# EAGLE design nano shield (EAGLE 8.6.1)
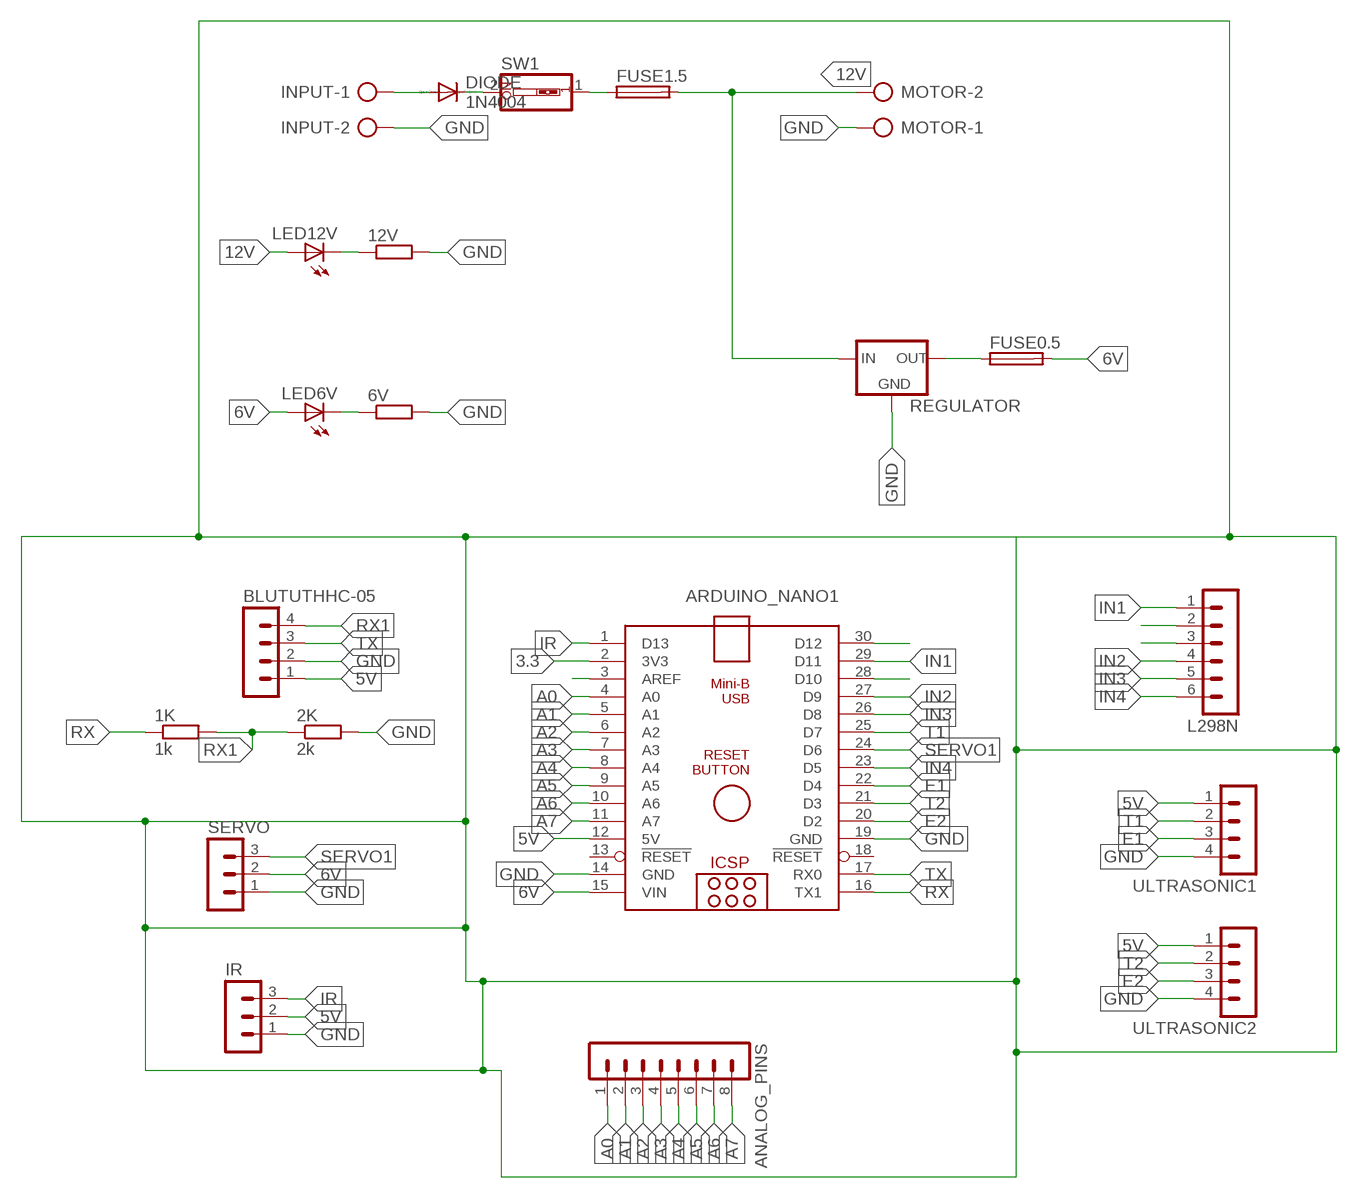
[diagram p0: schematic, sheet 1]

## Parts
1K  1k  R-EU_0207/10  [0207/10]
2K  2k  R-EU_0207/10  [0207/10]
6V  R-EU_0204/7  [0204/7]
12V  R-EU_0204/7  [0204/7]
ANALOG_PINS  MA08-1  [MA08-1]
ARDUINO_NANO1  ARDUINO_NANO  [ARDUINO_NANO]
BLUTUTHHC-05  MA04-1  [MA04-1]
DIODE  1N4004  [DO41-10]
FUSE0.5  SH22,5  [SH22,5]
FUSE1.5  SH22,5  [SH22,5]
INPUT  AK500/2-H  [AK500/2-H]
IR  MA03-1  [MA03-1]
L298N  MA06-1  [MA06-1]
LED6V  LEDLSU260  [LSU260]
LED12V  LEDLSU260  [LSU260]
MOTOR  AK500/2-H  [AK500/2-H]
REGULATOR  78XXS  [78XXS]
SERVO  MA03-1  [MA03-1]
SW1  SW_DIP-1  [EDG-01]
ULTRASONIC1  MA04-1  [MA04-1]
ULTRASONIC2  MA04-1  [MA04-1]

## Nets
3.3: ARDUINO_NANO1.2(3V3)
5V: ARDUINO_NANO1.12(5V) BLUTUTHHC-05.1 IR.2 ULTRASONIC1.1 ULTRASONIC2.1
6V: ARDUINO_NANO1.15(VIN) FUSE0.5.2 LED6V.A SERVO.2
12V: FUSE1.5.2 LED12V.A MOTOR.2 REGULATOR.IN
A0: ANALOG_PINS.1 ARDUINO_NANO1.4(A0)
A1: ANALOG_PINS.2 ARDUINO_NANO1.5(A1)
A2: ANALOG_PINS.3 ARDUINO_NANO1.6(A2)
A3: ANALOG_PINS.4 ARDUINO_NANO1.7(A3)
A4: ANALOG_PINS.5 ARDUINO_NANO1.8(A4)
A5: ANALOG_PINS.6 ARDUINO_NANO1.9(A5)
A6: ANALOG_PINS.7 ARDUINO_NANO1.10(A6)
A7: ANALOG_PINS.8 ARDUINO_NANO1.11(A7)
E1: ARDUINO_NANO1.22(D4) ULTRASONIC1.3
E2: ARDUINO_NANO1.20(D2) ULTRASONIC2.3
GND: 2K.2 6V.2 12V.2 ARDUINO_NANO1.14(GND) ARDUINO_NANO1.19(GND) BLUTUTHHC-05.2 INPUT.2 IR.1 MOTOR.1 REGULATOR.GND SERVO.1 ULTRASONIC1.4 ULTRASONIC2.4
IN1: ARDUINO_NANO1.30(D12) L298N.1
IN2: ARDUINO_NANO1.27(D9) L298N.4
IN3: ARDUINO_NANO1.26(D8) L298N.5
IN4: ARDUINO_NANO1.23(D5) L298N.6
IR: ARDUINO_NANO1.1(D13) IR.3
N$1: DIODE.A INPUT.1
N$2: DIODE.C SW1.2
N$3: FUSE1.5.1 SW1.1
N$5: FUSE0.5.1 REGULATOR.OUT
N$7: 6V.1 LED6V.K(C)
N$9: 12V.1 LED12V.K(C)
N$11: ARDUINO_NANO1.3(AREF)
PWM1: ARDUINO_NANO1.29(D11) L298N.2
PWM2: ARDUINO_NANO1.28(D10) L298N.3
RX: 1K.1 ARDUINO_NANO1.16(TX1)
RX1: 1K.2 2K.1 BLUTUTHHC-05.4
SERVO1: ARDUINO_NANO1.24(D6) SERVO.3
T1: ARDUINO_NANO1.25(D7) ULTRASONIC1.2
T2: ARDUINO_NANO1.21(D3) ULTRASONIC2.2
TX: ARDUINO_NANO1.17(RX0) BLUTUTHHC-05.3
Unconnected: ARDUINO_NANO1.13(!RESET) ARDUINO_NANO1.18(!RESET)

## Library data of the parts
1K 2K = rcl:R-EU_: RESISTOR, European symbol; SPICEPREFIX: R
6V 12V = resistor:R-EU_: RESISTOR, European symbol
ANALOG_PINS = con-lstb:MA08-1: PIN HEADER; OC_FARNELL: unknown; OC_NEWARK: unknown
ARDUINO_NANO1 = ArduinoNanoV30:ARDUINO_NANO: Arduino Nano V3.0 Overview: The Arduino Nano is a small, complete, and breadboard-friendly board based on the ATmega328 (Arduino Nano 3.x) or ATmega168 (Arduino Nano 2.x). It has more or less the same functionality of the Arduino Duemilanove, but in a different package. It lacks only a DC power jack, and works with a Mini-B USB cable instead of a standard one. The Nano was designed and is being produced by Gravitech. Specifications: Microcontroller Atmel ATmega168 or ATmega328 Operating Voltage (logic level) 5 V Input Voltage (recommended) 7-12 V Input Voltage (limits) 6-20 V Digital I/O Pins 14 (of which 6 provide PWM output) Analog Input Pins 8 DC Current per I/O Pin 40 mA Flash Memory 16 KB (ATmega168) or 32 KB (ATmega328) of which 2 KB used by bootloader SRAM 1 KB (ATmega168) or 2 KB (ATmega328) EEPROM 512 bytes (ATmega168) or 1 KB (ATmega328) Clock Speed 16 MHz Dimensions 0.73" x 1.70" Length 45 mm Width 18 mm Weigth 5 g Power: The Arduino Nano can be powered via the Mini-B USB connection, 6-20V unregulated external power supply (pin 30), or 5V regulated external power supply (pin 27). The power source is automatically selected to the highest voltage source. Memory: The ATmega168 has 16 KB of flash memory for storing code (of which 2 KB is used for the bootloader); the ATmega328 has 32 KB, (also with 2 KB used for the bootloader). The ATmega168 has 1 KB of SRAM and 512 bytes of EEPROM (which can be read and written with the EEPROM library); the ATmega328 has 2 KB of SRAM and 1 KB of EEPROM. Input and Output: Each of the 14 digital pins on the Nano can be used as an input or output, using pinMode(), digitalWrite(), and digitalRead() functions. They operate at 5 volts. Each pin can provide or receive a maximum of 40 mA and has an internal pull-up resistor (disconnected by default) of 20-50 kOhms. In addition, some pins have specialized functions. Visit Arduino - ArduinoBoardNano <https://www.arduino.cc/en/Main/ArduinoBoardNano>
BLUTUTHHC-05 ULTRASONIC1 ULTRASONIC2 = con-lstb:MA04-1: PIN HEADER; OC_FARNELL: unknown; OC_NEWARK: unknown
DIODE = diode:1N4004: DIODE general purpose rectifier, 1 A
FUSE0.5 FUSE1.5 = fuse:SH22,5: FUSE HOLDER grid 22,5 mm, OGN0031 8201, Schurter (Buerklin); MF: SCHURTER; MPN: 0031.8201; OC_FARNELL: 1162740; OC_NEWARK: 96F8317
INPUT MOTOR = con-ptr500:AK500/2-H: CONNECTOR Aug. 2004 / PTR Meßtechnik: Die Bezeichnung der Serie AK505 wurde geändert. Es handelt sich hierbei um AK500 in horizontaler Ausführung.; OC_FARNELL: unknown; OC_NEWARK: unknown
IR SERVO = con-lstb:MA03-1: PIN HEADER; OC_FARNELL: unknown; OC_NEWARK: unknown
L298N = con-lstb:MA06-1: PIN HEADER; OC_FARNELL: unknown; OC_NEWARK: unknown
LED6V LED12V = led:LED: LED OSRAM: - CHIPLED LG R971, LG N971, LY N971, LG Q971, LY Q971, LO R971, LY R971 LH N974, LH R974 LS Q976, LO Q976, LY Q976 LO Q996 - Hyper CHIPLED LW Q18S LB Q993, LB Q99A, LB R99A - SideLED LS A670, LO A670, LY A670, LG A670, LP A670 LB A673, LV A673, LT A673, LW A673 LH A674 LY A675 LS A676, LA A676, LO A676, LY A676, LW A676 LS A679, LY A679, LG A679 - Hyper Micro SIDELED® LS Y876, LA Y876, LO Y876, LY Y876 LT Y87S - SmartLED LW L88C, LW L88S LB L89C, LB L89S, LG L890 LS L89K, LO L89K, LY L89K LS L896, LA L896, LO L896, LY L896 - TOPLED LS T670, LO T670, LY T670, LG T670, LP T670 LSG T670, LSP T670, LSY T670, LOP T670, LYG T670 LG T671, LOG T671, LSG T671 LB T673, LV T673, LT T673, LW T673 LH T674 LS T676, LA T676, LO T676, LY T676, LB T676, LH T676, LSB T676, LW T676 LB T67C, LV T67C, LT T67C, LS T67K, LO T67K, LY T67K, LW E67C LS E67B, LA E67B, LO E67B, LY E67B, LB E67C, LV E67C, LT E67C LW T67C LS T679, LY T679, LG T679 LS T770, LO T770, LY T770, LG T770, LP T770 LB T773, LV T773, LT T773, LW T773 LH T774 LS E675, LA E675, LY E675, LS T675 LS T776, LA T776, LO T776, LY T776, LB T776 LHGB T686 LT T68C, LB T68C - Hyper Mini TOPLED® LB M676 - Mini TOPLED Santana® LG M470 LS M47K, LO M47K, LY M47K Source: http://www.osram.convergy.de LUXEON: - LUMILED® LXK2-PW12-R00, LXK2-PW12-S00, LXK2-PW14-U00, LXK2-PW14-V00 LXK2-PM12-R00, LXK2-PM12-S00, LXK2-PM14-U00 LXK2-PE12-Q00, LXK2-PE12-R00, LXK2-PE12-S00, LXK2-PE14-T00, LXK2-PE14-U00 LXK2-PB12-K00, LXK2-PB12-L00, LXK2-PB12-M00, LXK2-PB14-N00, LXK2-PB14-P00, LXK2-PB14-Q00 LXK2-PR12-L00, LXK2-PR12-M00, LXK2-PR14-Q00, LXK2-PR14-R00 LXK2-PD12-Q00, LXK2-PD12-R00, LXK2-PD12-S00 LXK2-PH12-R00, LXK2-PH12-S00 LXK2-PL12-P00, LXK2-PL12-Q00, LXK2-PL12-R00 Source: www.luxeon.com KINGBRIGHT: KA-3528ASYC Source: www.kingbright.com
REGULATOR = v-reg:78XXS: VOLTAGE REGULATOR
SW1 = special:SW_DIP-1: DIP SWITCH

## Board
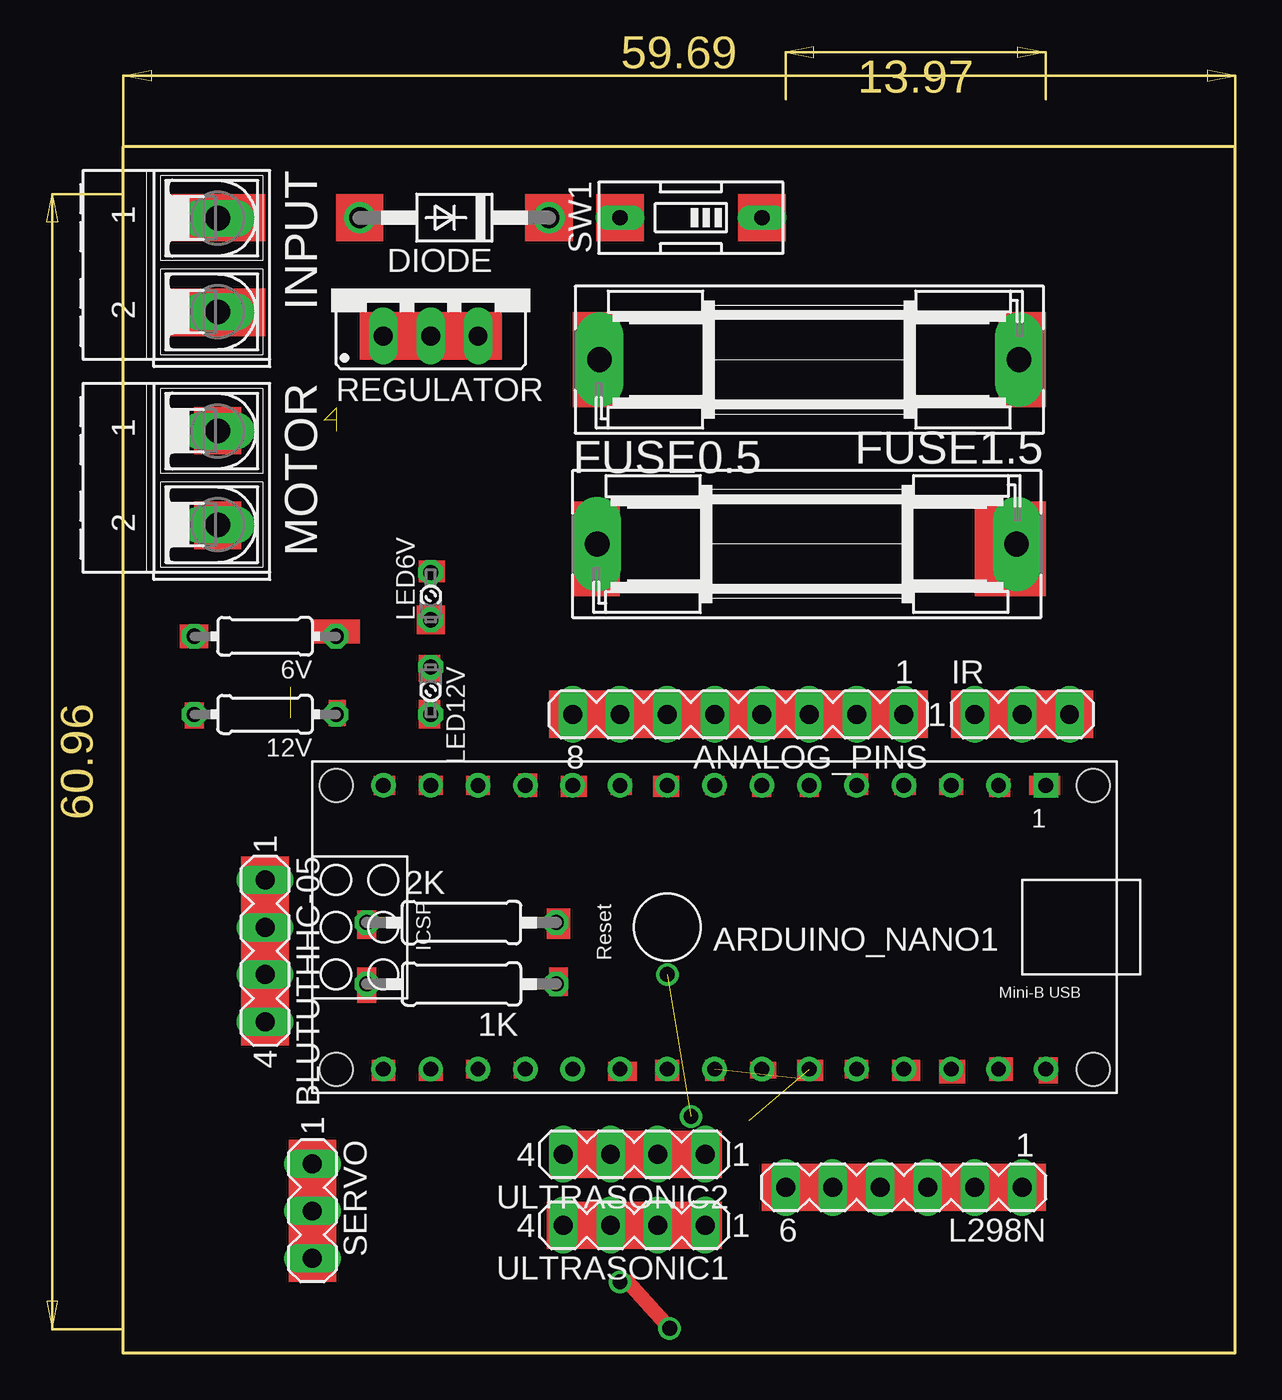
[diagram p1: board, top side]
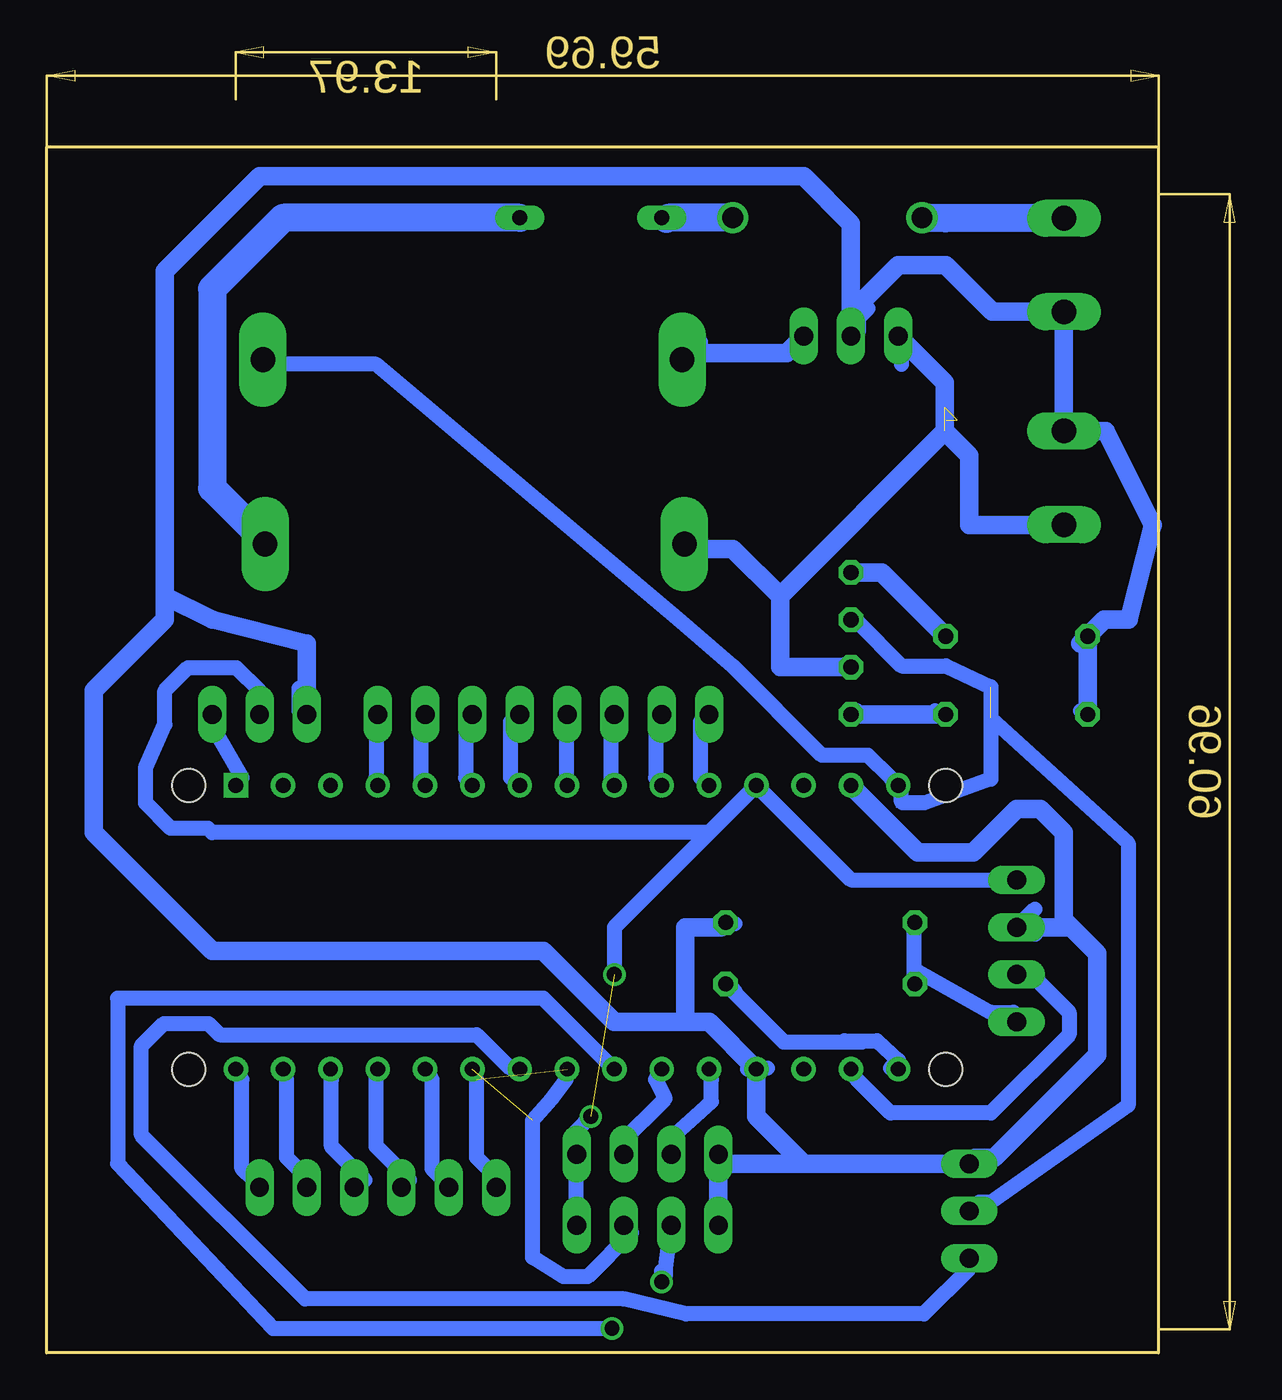
[diagram p2: board, bottom side, seen from below]

Size 59.69 x 64.77 mm. Coordinates in mm from the lower left corner, seen from the top.
Outline: 0,0 59.69,0 59.69,64.77 0,64.77 0,0
Copper layers (1*16): Top 0.035mm / dielectric 1.5mm / Bottom 0.035mm
Design rules "default *": minimum track width 0.8mm, minimum drill 0.8mm, track to track 0.4mm, track to pad 0.4mm, pad to pad 6mil, via to via 6mil, smd to smd 6mil, copper to edge 40mil, drill to drill 6mil, minimum pad ring 10mil, minimum via ring 8mil, stop-mask expansion 4mil, vias tented up to drill 0mil, thermal gap 10mil

### Footprints (pad centres in the part's own frame; a part is rotated, then mirrored left to right if it is on the bottom)
0207/10 = drill 0.813 octagon: 1 -5.08,0; 2 5.08,0
0204/7 = drill 0.813 octagon: 1 -3.81,0; 2 3.81,0
MA08-1 = drill 1.016 long: 1 -8.89,0; 2 -6.35,0; 3 -3.81,0; 4 -1.27,0; 5 1.27,0; 6 3.81,0; 7 6.35,0; 8 8.89,0
ARDUINO_NANO = drill 0.8 square: 1 -20.32,-7.62 | drill 0.8: 2 -17.78,-7.62; 3 -15.24,-7.62; 4 -12.7,-7.62; 5 -10.16,-7.62; 6 -7.62,-7.62; 7 -5.08,-7.62; 8 -2.54,-7.62; 9 0,-7.62; 10 2.54,-7.62; 11 5.08,-7.62; 12 7.62,-7.62; 13 10.16,-7.62; 14 12.7,-7.62; 15 15.24,-7.62; 16 15.24,7.62; 17 12.7,7.62; 18 10.16,7.62; 19 7.62,7.62; 20 5.08,7.62; 21 2.54,7.62; 22 0,7.62; 23 -2.54,7.62; 24 -5.08,7.62; 25 -7.62,7.62; 26 -10.16,7.62; 27 -12.7,7.62; 28 -15.24,7.62; 29 -17.78,7.62; 30 -20.32,7.62 | hole 1.778: -22.86,-7.62; -22.86,7.62; 17.78,7.62; 17.78,-7.62
MA04-1 = drill 1.016 long: 1 -3.81,0; 2 -1.27,0; 3 1.27,0; 4 3.81,0
DO41-10 = drill 1.118: A 5.08,0; C -5.08,0
SH22,5 = drill 1.321 pad 2.54 long: 1 -11.252,0; 2 11.252,0
AK500/2-H = drill 1.321 long: 1 -2.515,0; 2 2.515,0
MA03-1 = drill 1.016 long: 1 -2.54,0; 2 0,0; 3 2.54,0
MA06-1 = drill 1.016 long: 1 -6.35,0; 2 -3.81,0; 3 -1.27,0; 4 1.27,0; 5 3.81,0; 6 6.35,0
LSU260 = drill 0.813 octagon: A -1.27,0; K 1.27,0
78XXS = drill 1.016 long: GND 0,-2.54; IN -2.54,-2.54; OUT 2.54,-2.54
EDG-01 = drill 0.813 long: 1 0,-3.81; 2 0,3.81

### Placement (x,y rotation side)
1K  18.16,19.81 180 top
2K  18.16,23.11 0 top
6V  7.62,38.48 180 top
12V  7.62,34.29 180 top
ANALOG_PINS  33.02,34.29 180 top
ARDUINO_NANO1  29.21,22.86 180 top
BLUTUTHHC-05  7.62,21.59 270 top
DIODE  17.78,60.96 180 top
FUSE0.5  36.83,53.34 0 top
FUSE1.5  36.7,43.43 180 top
INPUT  5.08,58.42 270 top
IR  48.26,34.29 0 top
L298N  41.91,8.89 180 top
LED6V  16.51,40.64 90 top
LED12V  16.51,35.56 270 top
MOTOR  5.08,46.99 270 top
REGULATOR  16.51,57.15 0 top
SERVO  10.16,7.62 270 top
SW1  30.48,60.96 90 top
ULTRASONIC1  27.43,6.86 180 top
ULTRASONIC2  27.43,10.67 180 top

### Tracks (layer width: path | path; a pad name or v marks a point on that pad's centre or on a via)
5V  (via drill 0.8)  (1 unrouted)
  Bottom 0.8: ULTRASONIC1.1 31.29,7.05 31.29,10.65 ULTRASONIC2.1 31.24,11.94 v30.48,12.7 | 24.13,27.94 ARDUINO_NANO1.12 16.51,25.4 BLUTUTHHC-05.1 | 24.13,27.94 50.8,27.94 51.03,28.18 53.02,28.18 54.38,29.52 54.38,31.43 53.34,33.74 53.34,35.56 52.1,36.8 49.5,36.8 48.26,35.56 IR.2 | 24.13,27.94 29.21,22.86 v29.21,20.32
6V  (1 unrouted)
  Bottom 0.8: LED6V.A 16.2,39.29 13.8,36.89 11.4,36.89 9,35.76 9,30.81 12.55,29.54 13.75,29.54 13.8,29.59 13.8,30.29 ARDUINO_NANO1.15 14.4,30.89 15.6,32.09 18.07,32.09 22.87,36.89 25.8,39.43 42,53.09 48,53.09 FUSE0.5.2 | 9,34.1 1.64,27.37 1.64,13.29 9,8.09 9.6,8.09 SERVO.2
12V  (3 unrouted)
  Bottom 0.8: 16.8,36.89 LED12V.A | 25.2,43.03 FUSE1.5.2 | 13.8,53.09 13.8,54.29 REGULATOR.IN | 5.4,44.69 MOTOR.2
  Bottom 1: FUSE1.5.2 25.2,43.18 22.86,43.18 20.32,40.64 | 20.32,40.64 20.32,36.83 16.86,36.83 16.8,36.89 | 20.32,40.64 11.47,49.49 | REGULATOR.IN 11.47,52.11 11.47,49.49 | 11.47,49.49 10.16,48.18 10.16,44.45 5.11,44.45 MOTOR.2
A0
  Bottom 0.8: ARDUINO_NANO1.4 42,30.89 42,33.89 ANALOG_PINS.1
A1
  Bottom 0.8: ARDUINO_NANO1.5 39.6,30.89 39.6,33.89 ANALOG_PINS.2
A2
  Bottom 0.8: ARDUINO_NANO1.6 37.2,30.89 37.2,33.89 ANALOG_PINS.3
A3
  Bottom 0.8: ARDUINO_NANO1.7 34.8,30.89 34.8,33.89 ANALOG_PINS.4
A4
  Bottom 0.8: ARDUINO_NANO1.8 31.8,30.89 31.8,33.89 ANALOG_PINS.5
A5
  Bottom 0.8: ARDUINO_NANO1.9 29.4,30.89 29.4,33.89 ANALOG_PINS.6
A6
  Bottom 0.8: ARDUINO_NANO1.10 27,30.89 27,33.89 ANALOG_PINS.7
A7
  Bottom 0.8: ARDUINO_NANO1.11 24.6,30.89 24.6,33.89 ANALOG_PINS.8
E1  (via drill 0.8)
  Top 0.8: v29.34,1.31 27.09,3.81 v26.67,3.81
  Bottom 0.8: ARDUINO_NANO1.22 33.02,19.05 55.88,19.05 55.88,10.16 47.54,1.31 v29.34,1.31 | ULTRASONIC1.3 26.45,4.61 26.45,4.18 26.67,4.39 v26.67,3.81
E2
  Bottom 0.8: ARDUINO_NANO1.20 24,14.69 24,13.49 26.49,11.25 ULTRASONIC2.3
GND
  Bottom 0.8: 10.2,10.49 SERVO.1 | 23.49,11.25 ULTRASONIC2.4 | 6.6,22.49 7.2,22.49 BLUTUTHHC-05.2 6.64,23.84 | 4.2,34.49 12V.2 | 4.2,38.09 6V.2 3.6,38.69 | 15.6,56.09 16.2,55.49 16.2,54.89 REGULATOR.GND | 5.4,56.09 INPUT.2 5.4,55.49 | 5.4,50.09 MOTOR.1 4.8,49.49 | 21.6,15.29 ARDUINO_NANO1.19 | 46.13,35.69 46.13,34.49 IR.1 | 2K.2 22.73,23.05 | 21,15.29 ARDUINO_NANO1.19 | ARDUINO_NANO1.19 22.07,15.24
  Bottom 1: 16.2,54.89 16.2,56.19 13.97,58.42 11.43,58.42 8.91,55.91 INPUT.2 MOTOR.1 2.84,49.5 0.32,44.45 1.59,39.37 2.92,39.37 4.2,38.09 | 6V.2 12V.2 | REGULATOR.GND 16.51,60.64 19.05,63.18 48.26,63.18 53.34,58.1 53.34,40.64 | IR.1 45.72,38.1 50.8,39.37 53.34,40.64 | 53.34,40.64 53.34,39.37 57.15,35.56 57.15,27.94 50.8,21.59 33.02,21.59 29.21,17.78 25.4,17.78 | 25.4,17.78 24.13,17.78 ARDUINO_NANO1.19 21.59,12.7 19.05,10.16 | 2K.2 23.5,22.86 25.4,22.86 25.4,17.78 | 19.05,10.16 SERVO.1 9.83,10.49 8.81,10.49 3.3,16 3.3,21.46 4.7,22.86 | 19.05,10.16 23.11,10.16 ULTRASONIC2.4 ULTRASONIC1.4 | 4.7,22.86 BLUTUTHHC-05.2 | 4.7,22.86 5.08,23.24 5.08,27.94 6.35,29.21 7.62,29.21 7.83,29 7.83,28.99 9.94,26.87 12.92,26.87 16.51,30.46 ARDUINO_NANO1.14
IN1
  Bottom 0.8: ARDUINO_NANO1.30 49.2,14.69 49.2,9.89 48.6,9.29 L298N.1
IN2
  Bottom 0.8: ARDUINO_NANO1.27 42,14.69 42,11.09 40.2,9.29 L298N.4
IN3
  Bottom 0.8: ARDUINO_NANO1.26 39,14.69 39,9.89 38.4,9.29 L298N.5
IN4  (1 unrouted)
  Bottom 0.8: 36.6,14.69 36.6,10.49 35.4,9.29 L298N.6
IR
  Bottom 0.8: ARDUINO_NANO1.1 49.2,30.89 50.93,33.89 IR.3
N$1
  Bottom 0.8: 12.6,60.89 DIODE.A | 5.4,60.89 INPUT.1
  Bottom 1.5: INPUT.1 11.43,60.93 | 11.43,60.93 12.55,60.93 12.6,60.89 | 11.43,60.93
N$2
  Bottom 0.8: 26.4,60.89 SW1.2 | 23.4,60.89 DIODE.C
  Bottom 1.5: DIODE.C 26.33,60.96 26.4,60.89
N$3
  Bottom 0.8: 34.8,60.89 SW1.1 | 48,43.63 FUSE1.5.1
  Bottom 1.5: SW1.1 46.99,60.96 50.8,57.15 50.8,46.43 47.95,43.58 FUSE1.5.1
N$5
  Bottom 0.8: 24.6,54.29 25.2,53.69 FUSE0.5.1 | 19.2,54.29 REGULATOR.OUT
  Bottom 1: REGULATOR.OUT 19.97,53.69 25.2,53.69
N$7
  Bottom 1: 6V.1 14.86,41.91 LED6V.K
N$9
  Bottom 0.8: 12,34.49 12V.1 | 16.2,34.49 LED12V.K
  Bottom 1: LED12V.K 12V.1
PWM1
  Bottom 0.8: ARDUINO_NANO1.29 46.8,14.69 46.8,10.49 45.6,9.29 L298N.2
PWM2
  Bottom 0.8: ARDUINO_NANO1.28 44.4,14.69 44.4,11.09 42.6,9.29 L298N.3
RX
  Bottom 0.8: ARDUINO_NANO1.16 14.4,15.29 13.97,15.72 15.11,16.76 16.87,16.76 15.91,16.69 20.12,16.69 1K.1 22.73,19.43
RX1
  Bottom 0.8: 13.13,20.63 13.13,23.05 2K.1 | 13.13,20.63 13.13,20.03 1K.2 | 13.13,20.63 9,18.29 7.8,18.29 BLUTUTHHC-05.4
SERVO1
  Bottom 0.8: ARDUINO_NANO1.24 34.8,15.29 36.6,17.09 50.4,17.09 51,17.69 53.4,17.69 54.6,16.49 54.6,11.69 45.8,2.89 28.71,2.89 25.37,2.09 12.6,2.09 10.2,4.49 SERVO.3
T1  (1 unrouted)
  Bottom 0.8: 31.8,14.69 32.56,13.65 33.6,12.49 33.6,5.12 31.93,4.09 30.65,4.09 28.29,6.45 ULTRASONIC1.2
T2
  Bottom 0.8: ARDUINO_NANO1.21 27,14.69 26.49,13.65 28.89,11.25 ULTRASONIC2.2
TX
  Bottom 0.8: ARDUINO_NANO1.17 16.2,14.69 14.4,12.89 9,12.89 4.8,17.09 4.8,18.29 7.2,20.69 BLUTUTHHC-05.3
(copper drawn outside any net)
  shapes: Top area x62